# Altium schematic sheet IIS.SchDoc
size 240 x 169 mm
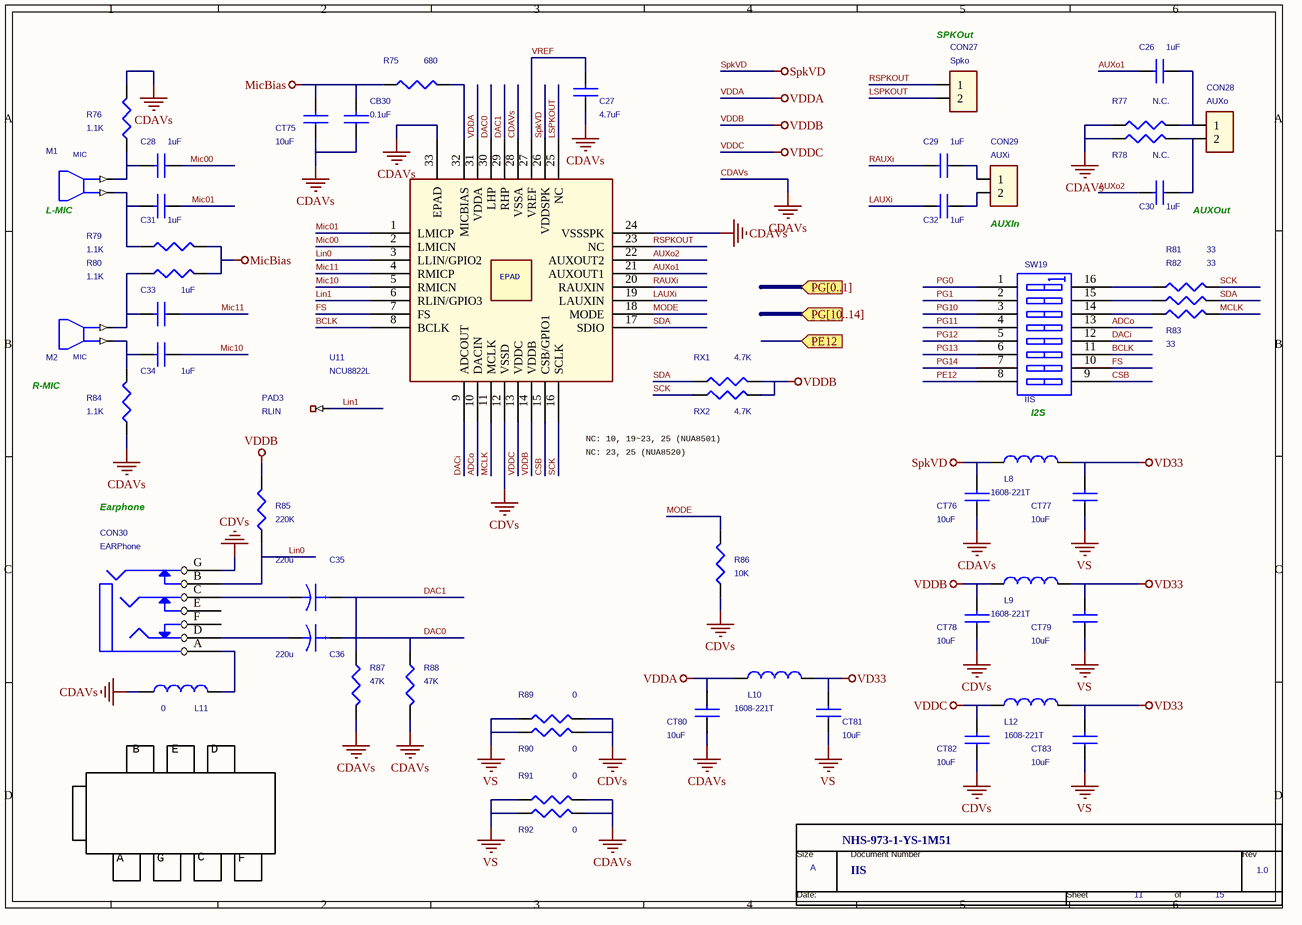
[diagram p0: IIS.SchDoc]

## Parts
*  RevCode: 1.0  Page Size: A  Page Number: 11  Page Count: 15  Doc: IIS  OrgName: NHS-973-1-YS-1M51  (hidden comment: TitleBlock0N)  (graphical)
C26  1uF  [C0603]
C27  4.7uF  [C0603]
C28  1uF  [C0603]
C29  1uF  [C0603]
C30  1uF  [C0603]
C31  1uF  [C0603]
C32  1uF  [C0603]
C33  1uF  [C0603]
C34  1uF  [C0603]
C35  220u  [CAP_B]
C36  220u  [CAP_B]
CB30  0.1uF  [C0603]
CON27  Spko  [Header_2x1_2.54mm]
CON28  AUXo  [Header_2x1_2.54mm]
CON29  AUXi  [Header_2x1_2.54mm]
CON30  EARPhone  [PHONE-PJK-631]
CT75  10uF  [C0603]
CT76  10uF  [C0603]
CT77  10uF  [C0603]
CT78  10uF  [C0603]
CT79  10uF  [C0603]
CT80  10uF  [C0603]
CT81  10uF  [C0603]
CT82  10uF  [C0603]
CT83  10uF  [C0603]
L8  1608-221T  [L0603]
L9  1608-221T  [L0603]
L10  1608-221T  [L0603]
L11  0  [L0603]
L12  1608-221T  [L0603]
M1  MIC  [9.7D2.54mm]
M2  MIC  [9.7D2.54mm]
PAD3  RLIN  [1PAD 1.25x1.25mm]
R75  680  [R0603]
R76  1.1K  [R0603]
R77  N.C.  [R0603]
R78  N.C.  [R0603]
R79  1.1K  [R0603]
R80  1.1K  [R0603]
R81  33  [R0603]
R82  33  [R0603]
R83  33  [R0603]
R84  1.1K  [R0603]
R85  220K  [R0603]
R86  10K  [R0603]
R87  47K  [R0603]
R88  47K  [R0603]
R89  0  [R0603]
R90  0  [R0603]
R91  0  [R0603]
R92  0  [R0603]
RX1  4.7K  [R0603]
RX2  4.7K  [R0603]
SW19  IIS  [DIPSWx8_2.54mm]
U11  NCU8822L  [QFN 32L, 5mm X 5mm, 0.5mm lead pitch]

## Ports
PE12 (in), PG[0..1] (in), PG[10..14] (in)

## Nets
CDAVs: C27.1 CB30.1 CT75.1 CT76.1 CT80.1 L11.1 R76.2 R77.1 R78.1 R84.1 R87.2 R88.2 R91.1 R92.1 U11.24(VSSSPK) U11.28(VSSA) U11.33(EPAD)
CDVs: CON30.G CT78.1 CT82.1 R86.1 R89.1 R90.1 U11.12(VSSD)
MicBias: CB30.2 CT75.2 R75.2 R79.2 R80.2
SpkVD: CT76.2 L8.1 U11.26(VDDSPK)
VD33: CT77.2 CT79.2 CT81.2 CT83.2 L8.2 L9.2 L10.2 L12.2
VDDA: CT80.2 L10.1 U11.31(VDDA)
VDDB: CT78.2 L9.1 R85.2 RX1.1 RX2.1 U11.14(VDDB)
VDDC: CT82.2 L12.1 U11.13(VDDC)
VS: CT77.1 CT79.1 CT81.1 CT83.1 R89.2 R90.2 R91.2 R92.2
ADCo: SW19.13(B4) U11.10(DACIN)
AUXo1: C26.2 U11.21(AUXOUT1)
AUXo2: C30.2 U11.22(AUXOUT2)
BCLK: SW19.11(B6) U11.8(BCLK)
CSB: SW19.9(B8) U11.15(CSB/GPIO1)
DAC0: C36.1 R88.1 U11.30(LHP)
DAC1: C35.1 R87.1 U11.29(RHP)
DACi: SW19.12(B5) U11.9(ADCOUT)
FS: SW19.10(B7) U11.7(FS)
LAUXi: C32.2 U11.19(LAUXIN)
Lin0: CON30.B R85.1 U11.3(LLIN/GPIO2)
Lin1: PAD3.\ U11.6(RLIN/GPIO3)
LSPKOUT: CON27.2 U11.25(NC)
MCLK: R83.1 U11.11(MCLK)
Mic00: C28.1 U11.2(LMICN)
Mic01: C31.1 U11.1(LMICP)
Mic10: C34.1 U11.5(RMICN)
Mic11: C33.1 U11.4(RMICP)
MODE: R86.2 U11.18(MODE)
PE12: SW19.8(A8)
PG0: SW19.1(A1)
PG1: SW19.2(A2)
PG10: SW19.3(A3)
PG11: SW19.4(A4)
PG12: SW19.5(A5)
PG13: SW19.6(A6)
PG14: SW19.7(A7)
RAUXi: C29.2 U11.20(RAUXIN)
RSPKOUT: CON27.1 U11.23(NC)
SCK: R81.1 RX2.2 U11.16(SCLK)
SDA: R82.1 RX1.2 U11.17(SDIO)
VREF: C27.2 U11.27(VREF)
NetC26_1: C26.1 CON28.1 R77.2
NetC28_2: C28.2 M1.2 R76.1
NetC29_1: C29.1 CON29.1
NetC30_1: C30.1 CON28.2 R78.2
NetC31_2: C31.2 M1.1 R79.1
NetC32_1: C32.1 CON29.2
NetC33_2: C33.2 M2.1 R80.1
NetC34_2: C34.2 M2.2 R84.2
NetC35_2: C35.2 CON30.C
NetC36_2: C36.2 CON30.D
NetCON30_A: CON30.A L11.2
NetR75_1: R75.1 U11.32(MICBIAS)
NetR81_2: R81.2 SW19.16(B1)
NetR82_2: R82.2 SW19.15(B2)
NetR83_2: R83.2 SW19.14(B3)

Not connected (* = marked no-connect by the designer): CON30 E F

## Notes on the sheet
- (near CON27) SPKOut
- (near M1) L-MIC
- AUXIn
- (near C30) AUXOut
- R-MIC
- NC: 23, 25 (NUA8520)
- NC: 10, 19~23, 25 (NUA8501)
- I2S
- Earphone
- (near L11) B
- (near L11) E
- (near L11) D
- A
- G
- C
- F
- (in symbol CAP-T) +
- (in symbol TitleBlock0N) Size; Document Number; Rev; Date:; Sheet; of

## Library data of the parts
C26-C34 CB30 CT75-CT83 = CAP NP
C35 C36 = CAP-T
CON27-CON29 = CON2
CON30 = PHONEJACK STEREO SW PJK-634_4: Vendor: 翬礨; Package: PHONE-PJK-631
L8-L12 = INDUCTOR
M1 M2 = MICROPHONE_0
PAD3 = 1PAD
R75-R92 RX1 RX2 = R
SW19 = SW DIP-8
U11 = NAU8501
* = TitleBlock0N: Page Create Date: April 25, 1995